# EAGLE design binarybox (EAGLE 7.5.0)
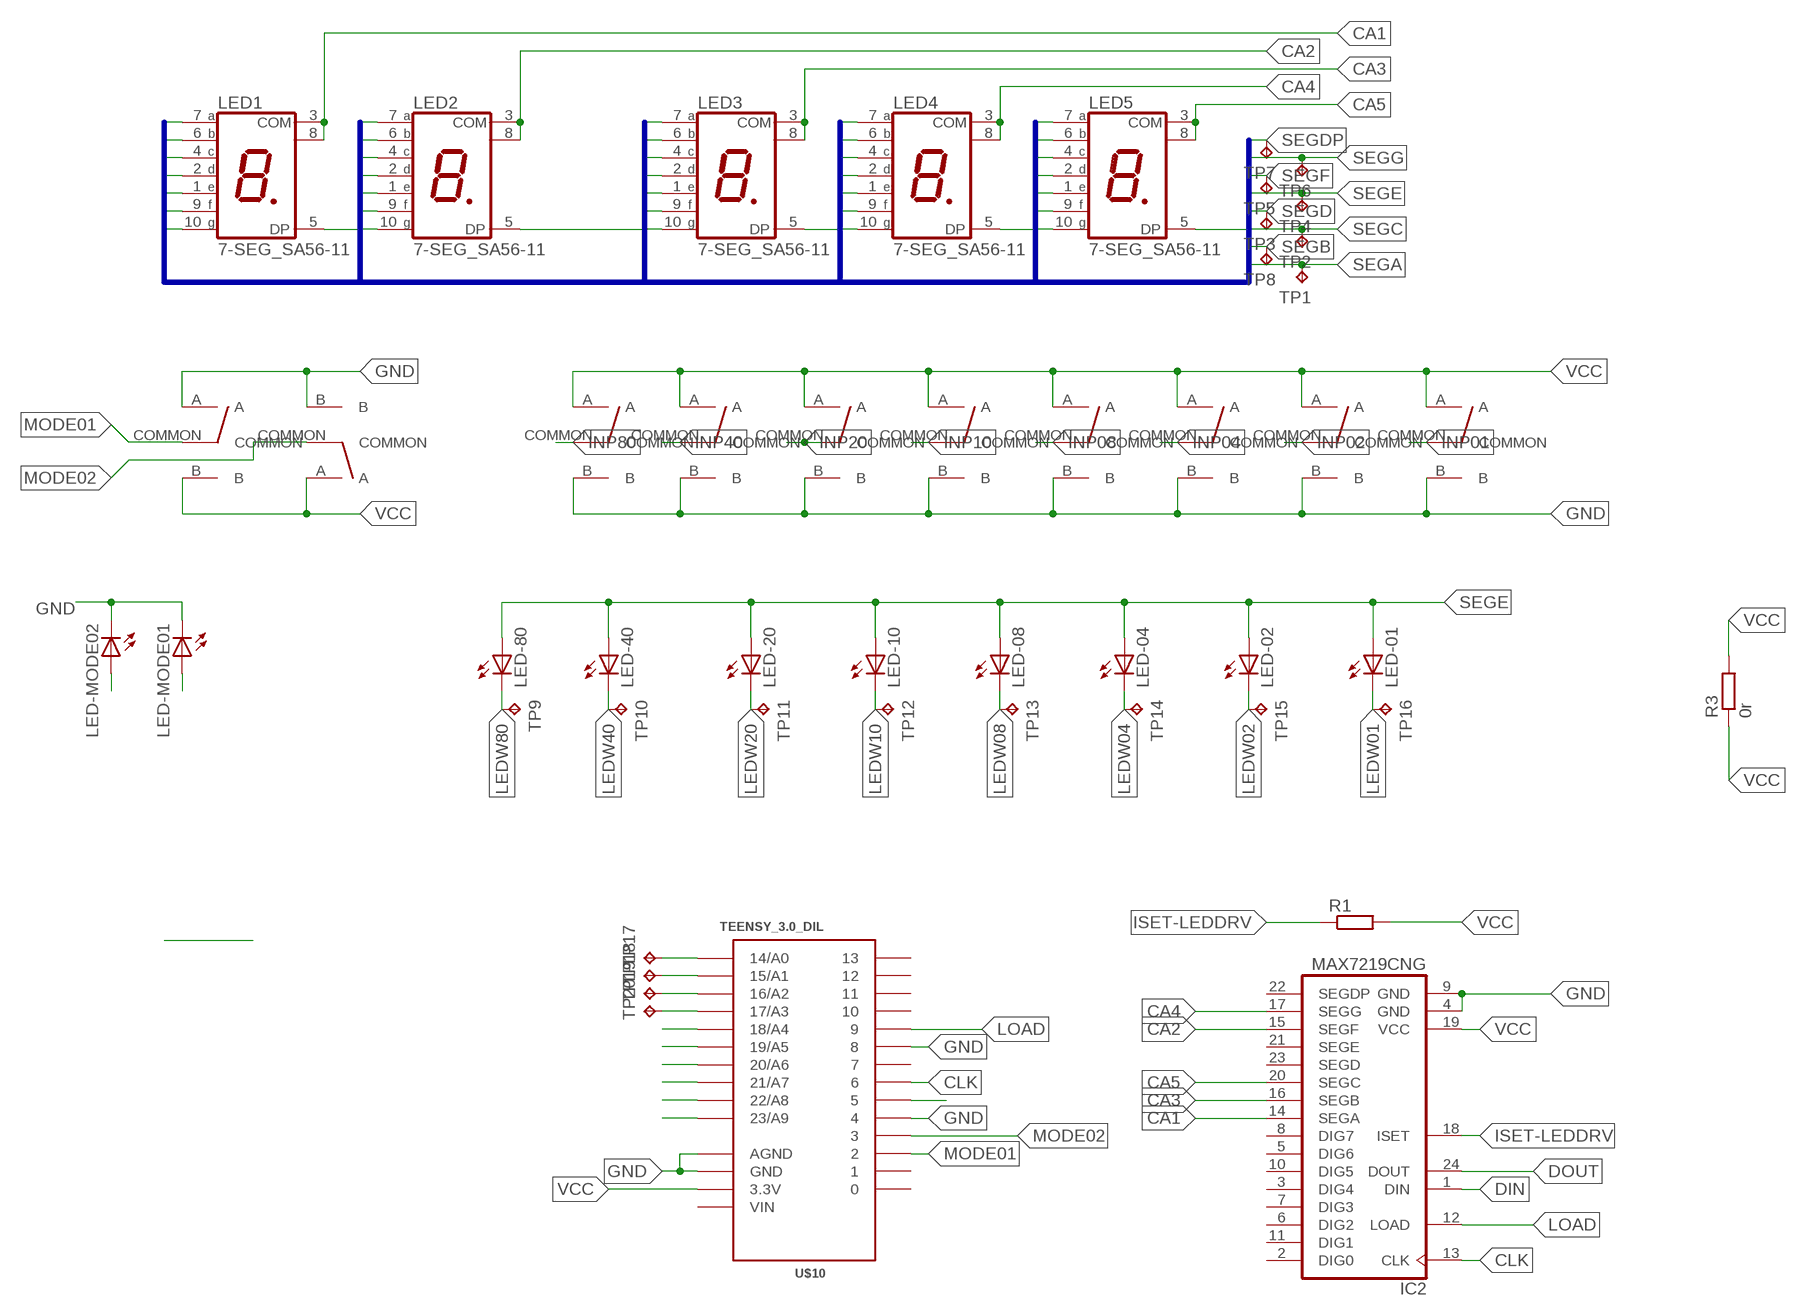
[diagram p0: schematic, sheet 1]

## Parts
IC2  MAX7219CNG  [DIL24-3]
LED1  7-SEG_SA56-11  [SA56-11]
LED2  7-SEG_SA56-11  [SA56-11]
LED3  7-SEG_SA56-11  [SA56-11]
LED4  7-SEG_SA56-11  [SA56-11]
LED5  7-SEG_SA56-11  [SA56-11]
LED-01  LED5MM  [LED5MM]
LED-02  LED5MM  [LED5MM]
LED-04  LED5MM  [LED5MM]
LED-08  LED5MM  [LED5MM]
LED-10  LED5MM  [LED5MM]
LED-20  LED5MM  [LED5MM]
LED-40  LED5MM  [LED5MM]
LED-80  LED5MM  [LED5MM]
LED-MODE01  LED5MM  [LED5MM]
LED-MODE02  LED5MM  [LED5MM]
R1  R-EU_0207/10  [0207/10]
R3  0r  R-EU_0207/10  [0207/10]
TP1  TPB1,27  [B1,27]
TP2  TPB1,27  [B1,27]
TP3  TPB1,27  [B1,27]
TP4  TPB1,27  [B1,27]
TP5  TPB1,27  [B1,27]
TP6  TPB1,27  [B1,27]
TP7  TPB1,27  [B1,27]
TP8  TPB1,27  [B1,27]
TP9  TPB1,27  [B1,27]
TP10  TPB1,27  [B1,27]
TP11  TPB1,27  [B1,27]
TP12  TPB1,27  [B1,27]
TP13  TPB1,27  [B1,27]
TP14  TPB1,27  [B1,27]
TP15  TPB1,27  [B1,27]
TP16  TPB1,27  [B1,27]
TP17  TPB1,27  [B1,27]
TP18  TPB1,27  [B1,27]
TP19  TPB1,27  [B1,27]
TP20  TPB1,27  [B1,27]
U$1  ARROW-AB-SWITCH  [333-333]
U$2  ARROW-AB-SWITCH  [333-333]
U$3  ARROW-AB-SWITCH  [333-333]
U$4  ARROW-AB-SWITCH  [333-333]
U$5  ARROW-AB-SWITCH  [333-333]
U$6  ARROW-AB-SWITCH  [333-333]
U$7  ARROW-AB-SWITCH  [333-333]
U$8  ARROW-AB-SWITCH  [333-333]
U$10  TEENSY_3.0_DIL  [TEENSY3-DIL]
U$11  ARROW-AB-SWITCH  [333-333]
U$13  ARROW-AB-SWITCH  [333-333]

## Nets
CA1: IC2.14(SEGA) LED1.3(COM) LED1.8(COM)
CA2: IC2.15(SEGF) LED2.3(COM) LED2.8(COM)
CA3: IC2.16(SEGB) LED3.3(COM) LED3.8(COM)
CA4: IC2.17(SEGG) LED4.3(COM) LED4.8(COM)
CA5: IC2.20(SEGC) LED5.3(COM) LED5.8(COM)
CLK: IC2.13(CLK) U$10.6
DIN: IC2.1(DIN) U$10.5
DOUT: IC2.24(DOUT)
GND: IC2.4(GND) IC2.9(GND) LED-MODE01.K(C) LED-MODE02.K(C) U$1.B U$2.B U$3.B U$4.B U$5.B U$6.B U$7.B U$8.B U$10.4 U$10.8 U$10.AGND U$10.GND U$11.A U$13.B
INP01: U$8.COMMON
INP02: U$7.COMMON
INP04: U$6.COMMON
INP08: U$5.COMMON
INP10: U$4.COMMON
INP20: U$3.COMMON
INP40: U$2.COMMON
INP80: U$1.COMMON
ISET-LEDDRV: IC2.18(ISET) R1.1
LEDMODE01: LED-MODE02.A
LEDMODE02: LED-MODE01.A
LEDW01: LED-01.K(C) TP16.TP
LEDW02: LED-02.K(C) TP15.TP
LEDW04: LED-04.K(C) TP14.TP
LEDW08: LED-08.K(C) TP13.TP
LEDW10: LED-10.K(C) TP12.TP
LEDW20: LED-20.K(C) TP11.TP
LEDW40: LED-40.K(C) TP10.TP
LEDW80: LED-80.K(C) TP9.TP
LOAD: IC2.12(LOAD) U$10.9
MODE01: U$10.2 U$11.COMMON
MODE02: U$10.3 U$13.COMMON
N$9: TP17.TP U$10.14/A0
N$10: TP18.TP U$10.15/A1
N$11: TP19.TP U$10.16/A2
N$12: TP20.TP U$10.17/A3
N$13: U$10.18/A4
N$14: U$10.19/A5
N$15: U$10.20/A6
N$16: U$10.21/A7
N$36: U$10.22/A8
N$37: U$10.23/A9
SEGA: LED1.7(A) LED2.7(A) LED3.7(A) LED4.7(A) LED5.7(A) TP1.TP
SEGB: LED1.6(B) LED2.6(B) LED3.6(B) LED4.6(B) LED5.6(B) TP8.TP
SEGC: LED1.4(C) LED2.4(C) LED3.4(C) LED4.4(C) LED5.4(C) TP2.TP
SEGD: LED1.2(D) LED2.2(D) LED3.2(D) LED4.2(D) LED5.2(D) TP3.TP
SEGDP: LED1.5(DP) LED2.5(DP) LED3.5(DP) LED4.5(DP) LED5.5(DP) TP7.TP
SEGE: LED1.1(E) LED2.1(E) LED3.1(E) LED4.1(E) LED5.1(E) LED-01.A LED-02.A LED-04.A LED-08.A LED-10.A LED-20.A LED-40.A LED-80.A TP4.TP
SEGF: LED1.9(F) LED2.9(F) LED3.9(F) LED4.9(F) LED5.9(F) TP5.TP
SEGG: LED1.10(G) LED2.10(G) LED3.10(G) LED4.10(G) LED5.10(G) TP6.TP
VCC: IC2.19(VCC) R1.2 R3.1 R3.2 U$1.A U$2.A U$3.A U$4.A U$5.A U$6.A U$7.A U$8.A U$10.3.3V U$11.B U$13.A
Unconnected: IC2.2(DIG0) IC2.3(DIG4) IC2.5(DIG6) IC2.6(DIG2) IC2.7(DIG3) IC2.8(DIG7) IC2.10(DIG5) IC2.11(DIG1) IC2.21(SEGE) IC2.22(SEGDP) IC2.23(SEGD) U$10.0 U$10.1 U$10.7 U$10.10 U$10.11 U$10.12 U$10.13

## Buses
SEG[10..17]

## Power pins joined to a net without a drawn wire
VIN: U$10.VIN

## Library data of the parts
IC2 = maxim:MAX7219CNG: LED DISPLAY DRIVER; MF: MAXIM; MPN: MAX7219CNG; OC_FARNELL: 1523914; OC_NEWARK: 34C4018
LED1-LED5 = display-kingbright:7-SEG_: Kingbright 14.2mm (0.56 INCH) SINGLE DIGIT NUMERIC DUISPLAY Source: SA56-11EWA(Ver1189471036.pdf; OC_FARNELL: unknown; OC_NEWARK: unknown
LED-01 LED-02 LED-04 LED-08 LED-10 LED-20 LED-40 LED-80 LED-MODE01 LED-MODE02 = led:LED: LED OSRAM: - CHIPLED LG R971, LG N971, LY N971, LG Q971, LY Q971, LO R971, LY R971 LH N974, LH R974 LS Q976, LO Q976, LY Q976 LO Q996 - Hyper CHIPLED LW Q18S LB Q993, LB Q99A, LB R99A - SideLED LS A670, LO A670, LY A670, LG A670, LP A670 LB A673, LV A673, LT A673, LW A673 LH A674 LY A675 LS A676, LA A676, LO A676, LY A676, LW A676 LS A679, LY A679, LG A679 - Hyper Micro SIDELED® LS Y876, LA Y876, LO Y876, LY Y876 LT Y87S - SmartLED LW L88C, LW L88S LB L89C, LB L89S, LG L890 LS L89K, LO L89K, LY L89K LS L896, LA L896, LO L896, LY L896 - TOPLED LS T670, LO T670, LY T670, LG T670, LP T670 LSG T670, LSP T670, LSY T670, LOP T670, LYG T670 LG T671, LOG T671, LSG T671 LB T673, LV T673, LT T673, LW T673 LH T674 LS T676, LA T676, LO T676, LY T676, LB T676, LH T676, LSB T676, LW T676 LB T67C, LV T67C, LT T67C, LS T67K, LO T67K, LY T67K, LW E67C LS E67B, LA E67B, LO E67B, LY E67B, LB E67C, LV E67C, LT E67C LW T67C LS T679, LY T679, LG T679 LS T770, LO T770, LY T770, LG T770, LP T770 LB T773, LV T773, LT T773, LW T773 LH T774 LS E675, LA E675, LY E675, LS T675 LS T776, LA T776, LO T776, LY T776, LB T776 LHGB T686 LT T68C, LB T68C - Hyper Mini TOPLED® LB M676 - Mini TOPLED Santana® LG M470 LS M47K, LO M47K, LY M47K Source: http://www.osram.convergy.de LUXEON: - LUMILED® LXK2-PW12-R00, LXK2-PW12-S00, LXK2-PW14-U00, LXK2-PW14-V00 LXK2-PM12-R00, LXK2-PM12-S00, LXK2-PM14-U00 LXK2-PE12-Q00, LXK2-PE12-R00, LXK2-PE12-S00, LXK2-PE14-T00, LXK2-PE14-U00 LXK2-PB12-K00, LXK2-PB12-L00, LXK2-PB12-M00, LXK2-PB14-N00, LXK2-PB14-P00, LXK2-PB14-Q00 LXK2-PR12-L00, LXK2-PR12-M00, LXK2-PR14-Q00, LXK2-PR14-R00 LXK2-PD12-Q00, LXK2-PD12-R00, LXK2-PD12-S00 LXK2-PH12-R00, LXK2-PH12-S00 LXK2-PL12-P00, LXK2-PL12-Q00, LXK2-PL12-R00 Source: www.luxeon.com KINGBRIGHT: KA-3528ASYC Source: www.kingbright.com
R1 R3 = resistor:R-EU_: RESISTOR, European symbol
TP1-TP20 = testpad:TP: Test pad
U$1-U$8 U$11 U$13 = switch-cr-arrow:ARROW-AB-SWITCH
U$10 = Teensy_3_and_LC_Series_Boards_v1.0:TEENSY_3.0_DIL: TEENSY 3.0 in a classic breadboard layout - pins between the two outer rows.

## Board
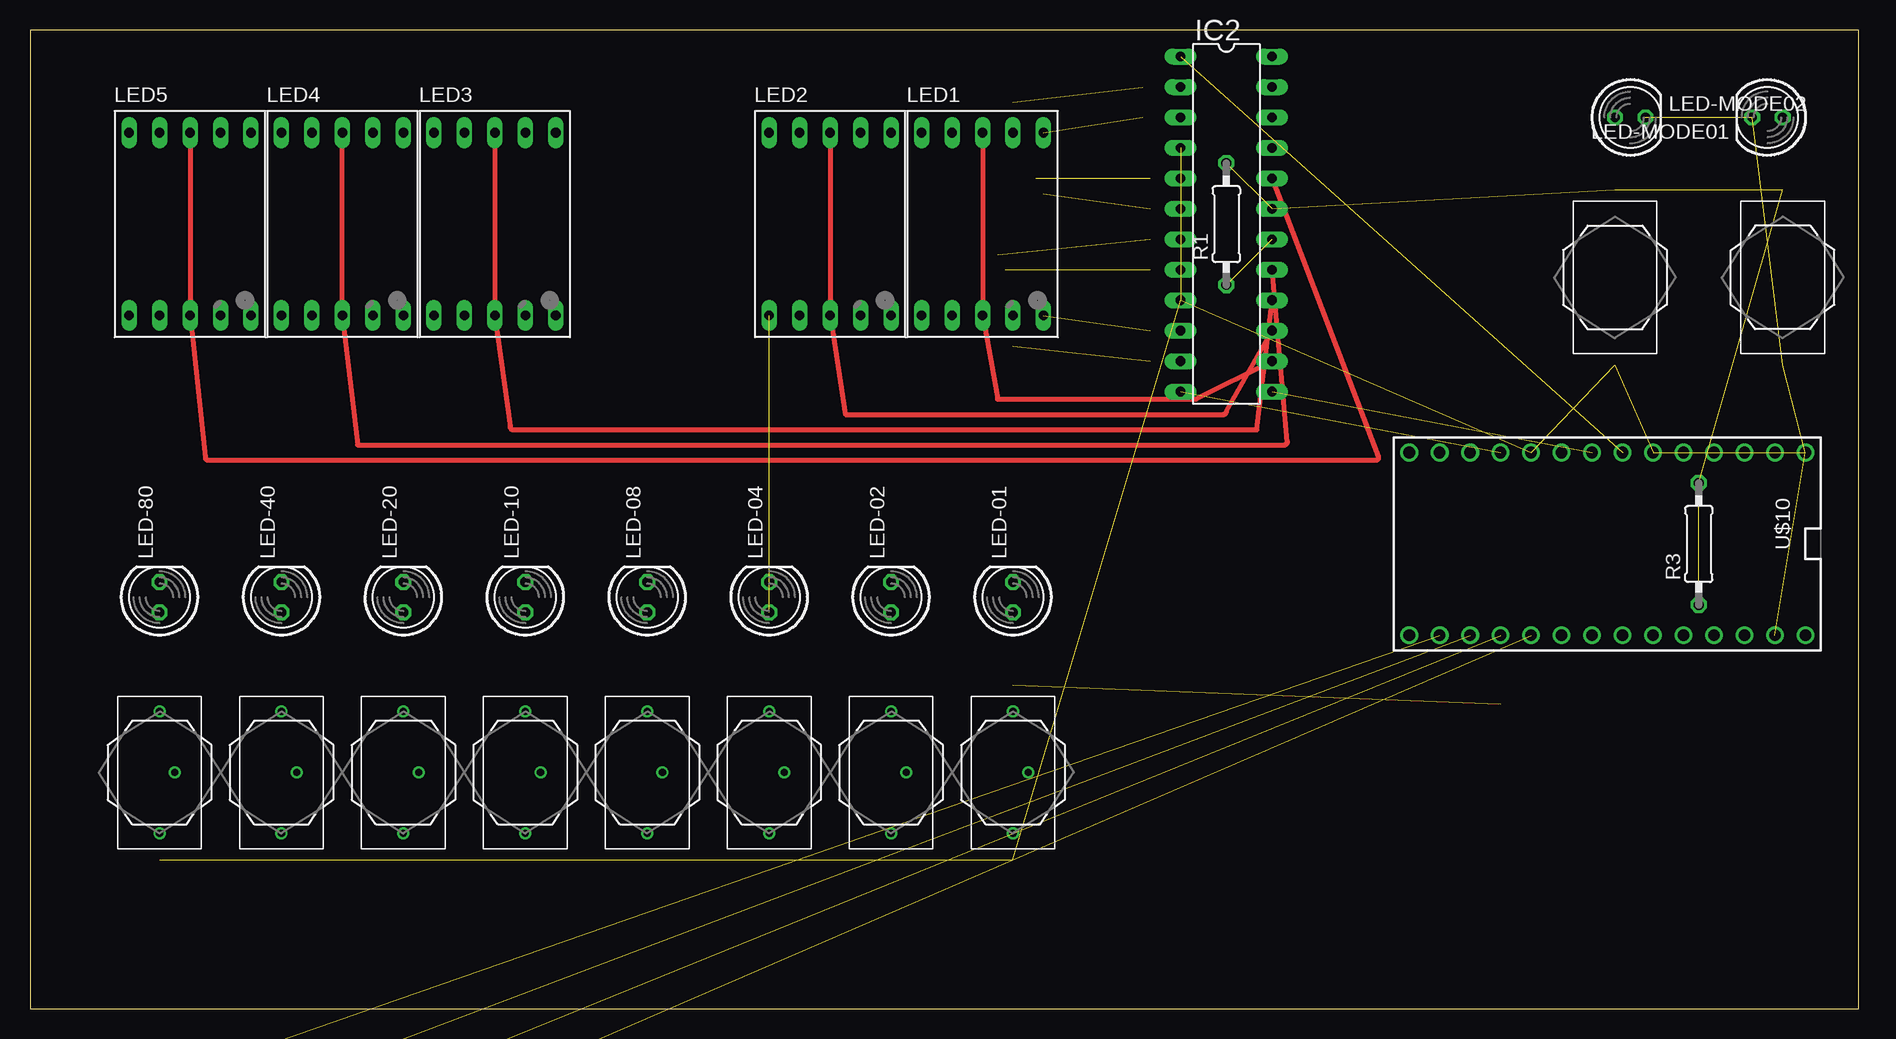
[diagram p1: board, top side]
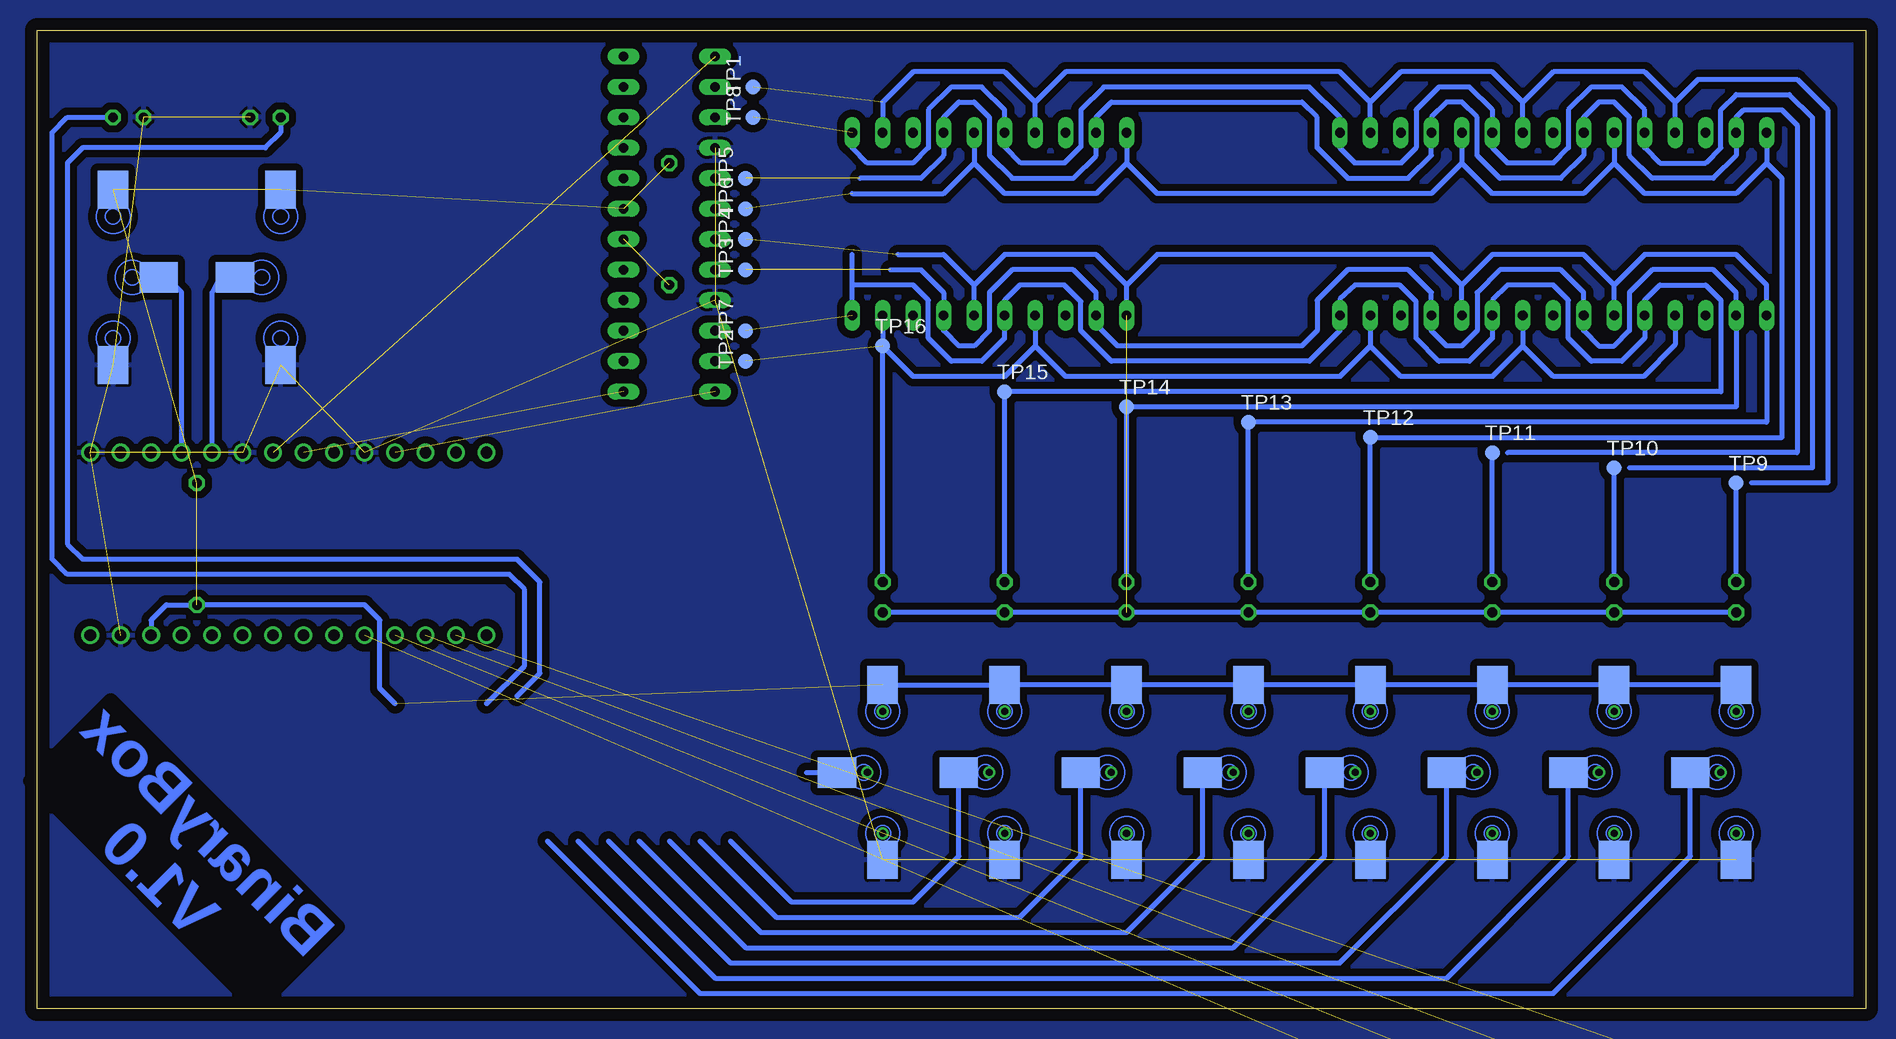
[diagram p2: board, bottom side, seen from below]

Size 152.38 x 81.59 mm. Coordinates in mm from the lower left corner, seen from the top.
Outline: 0,0 152.38,0 152.38,81.59 0,81.59 0,0
Copper layers (1*16): Top 0.035mm / dielectric 1.5mm / Bottom 0.035mm
Design rules "default": minimum track width 10mil, minimum drill 24mil, track to track 8mil, track to pad 8mil, pad to pad 8mil, via to via 8mil, smd to smd 8mil, copper to edge 40mil, drill to drill 8mil, minimum pad ring 10mil, minimum via ring 8mil, stop-mask expansion 4mil, vias tented up to drill 0mil, thermal gap 10mil

### Footprints (pad centres in the part's own frame; a part is rotated, then mirrored left to right if it is on the bottom)
DIL24-3 = drill 0.813 long: 1 -13.97,-3.81; 2 -11.43,-3.81; 3 -8.89,-3.81; 4 -6.35,-3.81; 5 -3.81,-3.81; 6 -1.27,-3.81; 7 1.27,-3.81; 8 3.81,-3.81; 9 6.35,-3.81; 10 8.89,-3.81; 11 11.43,-3.81; 12 13.97,-3.81; 13 13.97,3.81; 14 11.43,3.81; 15 8.89,3.81; 16 6.35,3.81; 17 3.81,3.81; 18 1.27,3.81; 19 -1.27,3.81; 20 -3.81,3.81; 21 -6.35,3.81; 22 -8.89,3.81; 23 -11.43,3.81; 24 -13.97,3.81
SA56-11 = drill 0.8 long: 1 -5.08,-7.62; 2 -2.54,-7.62; 3 0,-7.62; 4 2.54,-7.62; 5 5.08,-7.62; 6 5.08,7.62; 7 2.54,7.62; 8 0,7.62; 9 -2.54,7.62; 10 -5.08,7.62
LED5MM = drill 0.813 octagon: A -1.27,0; K 1.27,0
0207/10 = drill 0.813 octagon: 1 -5.08,0; 2 5.08,0
B1,27 = smd 1.27 x 1.27: TP 0,0
333-333 = smd 2.54 x 3.175 bottom: A 0,7.303; B 0,-7.303 | smd 3.175 x 2.54 bottom: COMMON 3.81,0
TEENSY3-DIL = drill 0.965: 0 -7.62,13.97; 1 -7.62,11.43; 2 -7.62,8.89; 3 -7.62,6.35; 3.3V 7.62,11.43; 4 -7.62,3.81; 5 -7.62,1.27; 6 -7.62,-1.27; 7 -7.62,-3.81; 8 -7.62,-6.35; 9 -7.62,-8.89; 10 -7.62,-11.43; 11 -7.62,-13.97; 12 -7.62,-16.51; 13 7.62,-16.51; 14/A0 7.62,-13.97; 15/A1 7.62,-11.43; 16/A2 7.62,-8.89; 17/A3 7.62,-6.35; 18/A4 7.62,-3.81; 19/A5 7.62,-1.27; 20/A6 7.62,1.27; 21/A7 7.62,3.81; 22/A8 7.62,6.35; 23/A9 7.62,8.89; AGND 7.62,13.97; GND -7.62,16.51; VIN 7.62,16.51

### Placement (x,y rotation side)
IC2  99.7,65.41 270 top
LED1  79.38,65.41 0 top
LED2  66.67,65.41 0 top
LED3  38.73,65.41 0 top
LED4  26.04,65.41 0 top
LED5  13.33,65.41 0 top
LED-01  81.92,34.29 90 top
LED-02  71.75,34.29 90 top
LED-04  61.59,34.29 90 top
LED-08  51.44,34.29 90 top
LED-10  41.27,34.29 90 top
LED-20  31.12,34.29 90 top
LED-40  20.96,34.29 90 top
LED-80  10.79,34.29 90 top
LED-MODE01  144.78,74.3 180 top
LED-MODE02  133.35,74.3 0 top
R1  99.7,65.41 90 top
R3  139.06,38.73 90 top
TP1  92.71,76.84 90 bottom
TP2  93.34,53.97 90 bottom
TP3  93.34,61.59 90 bottom
TP4  93.34,64.14 90 bottom
TP5  93.34,69.22 90 bottom
TP6  93.34,66.67 90 bottom
TP7  93.34,56.51 90 bottom
TP8  92.71,74.3 90 bottom
TP9  10.79,43.81 0 bottom
TP10  20.96,45.08 0 bottom
TP11  31.12,46.35 0 bottom
TP12  41.27,47.62 0 bottom
TP13  51.44,48.89 0 bottom
TP14  61.59,50.16 0 bottom
TP15  71.75,51.43 0 bottom
TP16  81.92,55.24 0 bottom
TP17  -2.54,-10.79 0 top  (outside the outline)
TP18  -2.54,-15.24 0 top  (outside the outline)
TP19  -2.54,-19.68 0 top  (outside the outline)
TP20  -2.54,-24.13 0 top  (outside the outline)
U$1  10.79,19.68 0 top
U$2  20.96,19.68 0 top
U$3  31.12,19.68 0 top
U$4  41.27,19.68 0 top
U$5  51.44,19.68 0 top
U$6  61.59,19.68 0 top
U$7  71.75,19.68 0 top
U$8  81.92,19.68 0 top
U$10  131.44,38.73 270 top
U$11  146.05,60.96 180 top
U$13  132.08,60.96 0 top

### Tracks (layer width: path | path; a pad name or v marks a point on that pad's centre or on a via)
CA1
  Top 0.406: IC2.14 97.16,50.8 80.64,50.8 LED1.3 LED1.8
CA2
  Top 0.406: IC2.15 99.7,49.78 arc-90 99.44,49.53 67.95,49.53 LED2.3 LED2.8
CA3
  Top 0.406: IC2.16 102.23,48.26 40.26,48.26 arc-90 40.01,48.51 LED3.3 LED3.8
CA4
  Top 0.406: IC2.17 104.78,47.24 arc-90 104.52,46.99 27.3,46.99 LED4.3 LED4.8
CA5
  Top 0.406: IC2.20 112.39,45.97 arc-90 112.14,45.72 14.86,45.72 arc-90 14.6,45.97 LED5.3 LED5.8
CLK  (1 unrouted)
DIN  (1 unrouted)
GND  (17 unrouted)
  pour Bottom (isolate 0.61): -3.81,88.9 159.38,88.9 159.38,-7.62 -3.81,-7.62
INP01
  Bottom 0.406: 88.27,19.68 U$8.COMMON
INP02
  Bottom 0.406: 94.61,13.97 89.53,8.89 79.38,8.89 75.56,12.7 U$7.COMMON
INP04
  Bottom 0.406: 97.16,13.97 90.81,7.62 70.48,7.62 65.41,12.7 U$6.COMMON
INP08
  Bottom 0.406: 99.7,13.97 92.08,6.35 61.59,6.35 55.25,12.7 U$5.COMMON
INP10
  Bottom 0.406: 102.23,13.97 93.34,5.08 52.7,5.08 45.09,12.7 U$4.COMMON
INP20
  Bottom 0.406: 104.78,13.97 94.61,3.81 43.81,3.81 34.93,12.7 U$3.COMMON
INP40
  Bottom 0.406: 107.31,13.97 95.89,2.54 34.93,2.54 24.77,12.7 U$2.COMMON
INP80
  Bottom 0.406: 109.86,13.97 97.16,1.27 26.04,1.27 14.6,12.7 U$1.COMMON
ISET-LEDDRV  (1 unrouted)
LEDMODE01
  Bottom 0.406: 112.39,26.04 110.49,27.94 110.49,35.56 112.39,37.46 148.59,37.46 149.86,38.73 149.86,70.48 148.59,71.76 133.35,71.76 132.08,73.03 LED-MODE02.A
LEDMODE02
  Bottom 0.406: 114.94,25.4 111.76,28.57 111.76,34.92 113.03,36.2 149.86,36.2 151.13,37.46 151.13,73.03 149.86,74.3 LED-MODE01.A
LEDW01
  Bottom 0.406: LED-01.K TP16.TP
LEDW02
  Bottom 0.406: LED-02.K TP15.TP
LEDW04
  Bottom 0.406: LED-04.K TP14.TP
LEDW08
  Bottom 0.406: LED-08.K TP13.TP
LEDW10
  Bottom 0.406: LED-10.K TP12.TP 6.99,47.62
LEDW20
  Bottom 0.406: LED-20.K TP11.TP
LEDW40
  Bottom 0.406: LED-40.K TP10.TP
LEDW80
  Bottom 0.406: LED-80.K TP9.TP
LOAD  (1 unrouted)
MODE01
  Bottom 0.406: U$10.2 140.34,59.69 141.6,60.96 U$11.COMMON
MODE02
  Bottom 0.406: U$10.3 137.79,59.69 137.16,60.96 U$13.COMMON
N$1  (via drill 0.6)
  other vias: 10.79,24.77
N$2  (via drill 0.6)
  other vias: 12.06,19.68
N$3  (via drill 0.6)
  other vias: 20.96,24.77
N$4  (via drill 0.6)
  other vias: 22.23,19.68
N$5  (via drill 0.6)
  other vias: 10.79,14.61
N$6
  Bottom 0.406: 8.25,57.15 8.25,48.89 51.44,48.89
N$7
  Bottom 0.406: 10.79,57.15 10.79,50.16 61.59,50.16
N$9  (1 unrouted)
N$10  (1 unrouted)
N$11  (1 unrouted)
N$12  (1 unrouted)
N$17  (via drill 0.6)
  other vias: 20.96,14.61
N$18  (via drill 0.6)
  other vias: 31.12,24.77
N$19  (via drill 0.6)
  other vias: 32.38,19.68
N$20  (via drill 0.6)
  other vias: 31.12,14.61
N$21  (via drill 0.6)
  other vias: 41.27,14.61
N$22  (via drill 0.6)
  other vias: 42.55,19.68
N$23  (via drill 0.6)
  other vias: 41.27,24.77
N$24  (via drill 0.6)
  other vias: 51.44,24.77
N$25  (via drill 0.6)
  other vias: 52.7,19.68
N$26  (via drill 0.6)
  other vias: 51.44,14.61
N$27  (via drill 0.6)
  other vias: 61.59,14.61
N$28  (via drill 0.6)
  other vias: 62.87,19.68
N$29  (via drill 0.6)
  other vias: 61.59,24.77
N$30  (via drill 0.6)
  other vias: 71.75,24.77
N$31  (via drill 0.6)
  other vias: 73.03,19.68
N$32  (via drill 0.6)
  other vias: 71.75,14.61
N$33  (via drill 0.6)
  other vias: 81.92,14.61
N$34  (via drill 0.6)
  other vias: 83.19,19.68
N$35  (via drill 0.6)
  other vias: 81.92,24.77
SEGA  (1 unrouted)
  Bottom 0.406: LED5.7 15.88,75.56 | LED4.7 28.58,75.56 | LED3.7 41.27,75.56 | LED2.7 69.22,75.56 | LED1.7 81.92,75.56 79.38,78.11 71.75,78.11 69.22,75.56 | 15.88,75.56 18.42,78.11 26.04,78.11 28.58,75.56 | 28.58,75.56 31.12,78.11 38.73,78.11 41.27,75.56 | 41.27,75.56 43.81,78.11 66.67,78.11 69.22,75.56 | 15.88,75.56 13.97,77.47 5.71,77.47 3.17,74.93 3.17,43.81 9.53,43.81
SEGB  (1 unrouted)
  Bottom 0.406: LED1.6 84.45,71.76 83.19,70.48 79.38,70.48 78.11,71.76 78.11,74.93 76.2,76.84 73.66,76.84 71.75,74.93 LED2.6 71.75,71.85 70.39,70.48 66.77,70.48 65.41,71.85 65.41,74.93 63.5,76.84 46.36,76.84 43.81,74.3 LED3.6 43.81,71.76 42.55,70.48 38.73,70.48 37.47,71.76 37.47,74.93 35.56,76.84 33.02,76.84 31.12,74.93 LED4.6 31.12,71.76 29.85,70.48 26.04,70.48 24.77,71.76 24.77,74.93 22.86,76.84 20.32,76.84 18.42,74.93 LED5.6 18.42,71.76 17.14,70.48 13.33,70.48 12.06,71.76 12.06,74.93 10.79,76.2 6.35,76.2 4.45,74.3 4.45,45.08 19.69,45.08
SEGC  (1 unrouted)
  Bottom 0.406: LED5.4 15.88,55.34 18.51,52.7 26.04,52.7 28.58,55.24 | LED4.4 28.58,55.24 | LED3.4 41.27,55.24 | LED2.4 69.22,55.24 | 41.27,55.24 43.81,52.7 66.67,52.7 69.22,55.24 | 41.27,55.24 38.73,52.7 31.12,52.7 28.58,55.24 | 69.22,55.24 71.75,52.7 79.38,52.7 81.92,55.24 LED1.4
SEGD  (1 unrouted)
  Bottom 0.406: LED5.2 10.79,59.69 12.7,61.59 17.78,61.59 19.69,59.69 19.69,56.51 20.96,55.24 22.23,55.24 23.5,56.51 LED4.2 23.5,59.69 25.4,61.59 30.48,61.59 32.38,59.69 32.38,56.51 33.66,55.24 34.93,55.24 36.2,56.51 LED3.2 36.2,59.69 38.1,61.59 43.18,61.59 45.72,59.05 45.72,56.51 46.99,55.24 62.34,55.24 64.13,57.04 LED2.2 64.13,59.69 66.04,61.59 71.12,61.59 73.03,59.69 73.03,56.51 74.3,55.24 75.56,55.24 76.84,56.51 LED1.2 76.84,59.69 78.74,61.59 81.28,61.59
SEGDP  (1 unrouted)
  Bottom 0.406: 84.45,60.32 79.38,60.32 78.11,59.05 78.11,55.88 76.2,53.97 73.66,53.97 71.75,55.88 LED2.5 71.75,59.05 70.48,60.32 66.77,60.32 65.41,58.96 65.41,56.51 62.87,53.97 46.36,53.97 43.81,56.51 LED3.5 43.81,59.13 42.55,60.32 38.83,60.32 37.47,58.96 37.47,55.88 35.56,53.97 33.02,53.97 31.12,55.88 LED4.5 31.12,59.05 29.85,60.32 26.04,60.32 24.77,59.05 24.77,55.88 22.86,53.97 20.32,53.97 18.42,55.88 LED5.5 18.42,59.05 17.14,60.32 13.33,60.32 12.06,59.05 12.06,51.43 71.75,51.43 | LED1.5 84.45,60.32 | 84.45,60.32 84.45,62.87
SEGE  (2 unrouted)
  Bottom 0.406: LED5.1 8.25,60.32 10.79,62.87 18.42,62.87 20.96,60.32 | LED4.1 20.96,60.32 | LED3.1 33.66,60.32 | LED2.1 61.59,60.32 | LED1.1 74.3,60.32 | 80.64,62.87 76.84,62.87 74.3,60.32 | 20.96,60.32 23.5,62.87 31.12,62.87 33.66,60.32 | 33.66,60.32 36.2,62.87 59.05,62.87 61.59,60.32 | 61.59,60.32 64.13,62.87 71.75,62.87 74.3,60.32 | LED-80.A LED-40.A LED-20.A LED-10.A LED-08.A LED-04.A LED-02.A LED-01.A
SEGF  (1 unrouted)
  Bottom 0.406: 83.82,69.22 78.74,69.22 76.84,71.12 LED1.9 76.84,74.3 75.56,75.56 74.3,75.56 73.03,74.3 73.03,71.12 71.12,69.22 66.04,69.22 64.13,71.12 LED2.9 64.13,74.3 62.87,75.56 46.99,75.56 45.72,74.3 45.72,71.76 43.18,69.22 38.1,69.22 36.2,71.12 LED3.9 36.2,74.3 34.93,75.56 33.66,75.56 32.38,74.3 32.38,71.12 30.48,69.22 25.4,69.22 23.5,71.12 LED4.9 23.5,74.3 22.23,75.56 20.96,75.56 19.69,74.3 19.69,71.12 17.78,69.22 12.7,69.22 10.79,71.12 LED5.9 10.79,74.3 10.16,74.93 6.99,74.93 5.71,73.66 5.71,46.35 29.85,46.35
SEGG  (1 unrouted)
  Bottom 0.406: 84.45,67.95 76.84,67.95 74.3,70.48 | LED4.10 20.96,70.48 | LED3.10 33.66,70.48 | LED2.10 61.59,70.48 | LED1.10 74.3,70.48 | 8.25,70.48 10.79,67.95 18.42,67.95 20.96,70.48 | 20.96,70.48 23.5,67.95 31.12,67.95 33.66,70.48 | 33.66,70.48 36.2,67.95 59.05,67.95 61.59,70.48 | 61.59,70.48 64.13,67.95 71.75,67.95 74.3,70.48 | LED5.10 8.25,70.48 | 8.25,70.48 6.99,69.22 6.99,47.62
VCC  (6 unrouted)
  Bottom 0.406: U$1.A U$2.A U$3.A U$4.A U$5.A U$6.A U$7.A U$8.A | 122.56,25.4 123.83,26.67 123.83,32.38 125.09,33.65 R3.1 141.6,33.65 142.88,32.38 U$10.3.3V

### Text on the board
Bottom: BinaryBox / V1.0
_tsilk: Mode | Decimal | Hex | B i n a r y